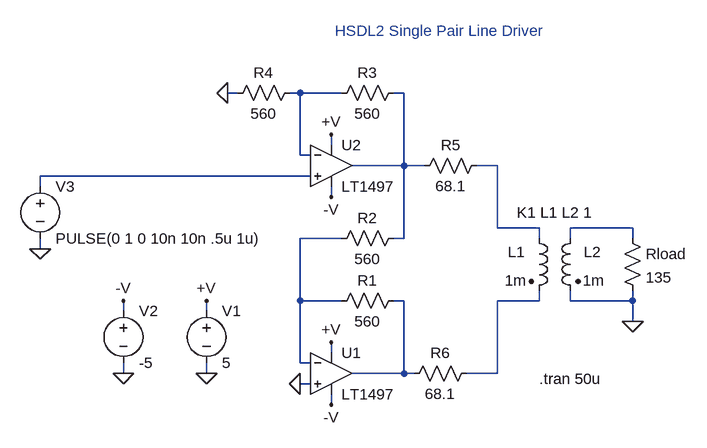
[diagram p0: schematic 1497.asc]
1497.asc, the LTspice schematic file:
Version 4
SHEET 1 896 680
WIRE 48 -224 32 -224
WIRE 144 -224 128 -224
WIRE 208 -224 144 -224
WIRE 304 -224 288 -224
WIRE 192 -144 192 -160
WIRE 144 -128 144 -224
WIRE 160 -128 144 -128
WIRE 304 -112 304 -224
WIRE 304 -112 224 -112
WIRE 336 -112 304 -112
WIRE 448 -112 416 -112
WIRE 160 -96 -256 -96
WIRE -256 -80 -256 -96
WIRE 192 -64 192 -80
WIRE 448 -16 448 -112
WIRE 512 -16 448 -16
WIRE 656 -16 560 -16
WIRE 208 0 144 0
WIRE 304 0 304 -112
WIRE 304 0 288 0
WIRE 512 0 512 -16
WIRE 560 0 560 -16
WIRE 656 0 656 -16
WIRE -256 16 -256 0
WIRE 144 96 144 0
WIRE 208 96 144 96
WIRE 304 96 288 96
WIRE 512 96 512 80
WIRE 512 96 448 96
WIRE 560 96 560 80
WIRE 656 96 656 80
WIRE 656 96 560 96
WIRE -128 112 -128 96
WIRE 0 112 0 96
WIRE 656 128 656 96
WIRE 192 176 192 160
WIRE 144 192 144 96
WIRE 160 192 144 192
WIRE -128 208 -128 192
WIRE 0 208 0 192
WIRE 304 208 304 96
WIRE 304 208 224 208
WIRE 320 208 304 208
WIRE 448 208 448 96
WIRE 448 208 400 208
WIRE 160 224 144 224
WIRE 192 256 192 240
FLAG 0 208 0
FLAG 192 160 +V
FLAG 0 96 +V
FLAG 192 256 -V
FLAG -128 208 0
FLAG -128 96 -V
FLAG 192 -160 +V
FLAG 192 -64 -V
FLAG 32 -224 0
FLAG 144 224 0
FLAG -256 16 0
FLAG 656 128 0
SYMBOL voltage 0 96 R0
SYMATTR InstName V1
SYMATTR Value 5
SYMBOL voltage -128 96 R0
SYMATTR InstName V2
SYMATTR Value -5
SYMBOL res 304 80 R90
WINDOW 0 0 56 VBottom 2
WINDOW 3 32 56 VTop 2
SYMATTR InstName R1
SYMATTR Value 560
SYMBOL opamps\\LT1497 192 144 R0
SYMATTR InstName U1
SYMBOL res 304 -16 R90
WINDOW 0 0 56 VBottom 2
WINDOW 3 32 56 VTop 2
SYMATTR InstName R2
SYMATTR Value 560
SYMBOL res 304 -240 R90
WINDOW 0 0 56 VBottom 2
WINDOW 3 32 56 VTop 2
SYMATTR InstName R3
SYMATTR Value 560
SYMBOL opamps\\LT1497 192 -176 R0
SYMATTR InstName U2
SYMBOL res 144 -240 R90
WINDOW 0 0 56 VBottom 2
WINDOW 3 32 56 VTop 2
SYMATTR InstName R4
SYMATTR Value 560
SYMBOL voltage -256 -96 R0
WINDOW 123 0 0 Left 2
WINDOW 39 0 0 Left 2
SYMATTR InstName V3
SYMATTR Value PULSE(0 1 0 10n 10n .5u 1u)
SYMBOL res 432 -128 R90
WINDOW 0 0 56 VBottom 2
WINDOW 3 32 56 VTop 2
SYMATTR InstName R5
SYMATTR Value 68.1
SYMBOL res 416 192 R90
WINDOW 0 0 56 VBottom 2
WINDOW 3 32 56 VTop 2
SYMATTR InstName R6
SYMATTR Value 68.1
SYMBOL ind2 496 -16 R0
WINDOW 0 -5 37 Right 2
WINDOW 3 -3 81 Right 2
SYMATTR InstName L1
SYMATTR Value 1m
SYMATTR Type ind
SYMBOL ind2 576 -16 M0
WINDOW 0 -5 37 Right 2
WINDOW 3 -3 81 Right 2
SYMATTR InstName L2
SYMATTR Value 1m
SYMATTR Type ind
SYMBOL res 640 -16 R0
SYMATTR InstName Rload
SYMATTR Value 135
TEXT 512 216 Left 2 !.tran 50u
TEXT 536 -24 Bottom 2 !K1 L1 L2 1
TEXT 360 -304 Bottom 2 ;HSDL2 Single Pair Line Driver

The netlist it stands for:
* 1497.asc
V1 +V 0 5
V2 -V 0 -5
R1 N007 N006 560
XU1 0 N006 +V -V N007 LT1497  ; pins In+ In- V+ V- OUT
R2 N002 N006 560
R3 N002 N001 560
XU2 N004 N001 +V -V N002 LT1497  ; pins In+ In- V+ V- OUT
R4 N001 0 560
V3 N004 0 PULSE(0 1 0 10n 10n .5u 1u)
R5 N003 N002 68.1
R6 N008 N007 68.1
L1 N003 N008 1m
L2 N005 0 1m
Rload N005 0 135
.tran 50u
K1 L1 L2 1
* HSDL2 Single Pair Line Driver
.backanno
.end